# Altium project PFC_Project.PrjPcb
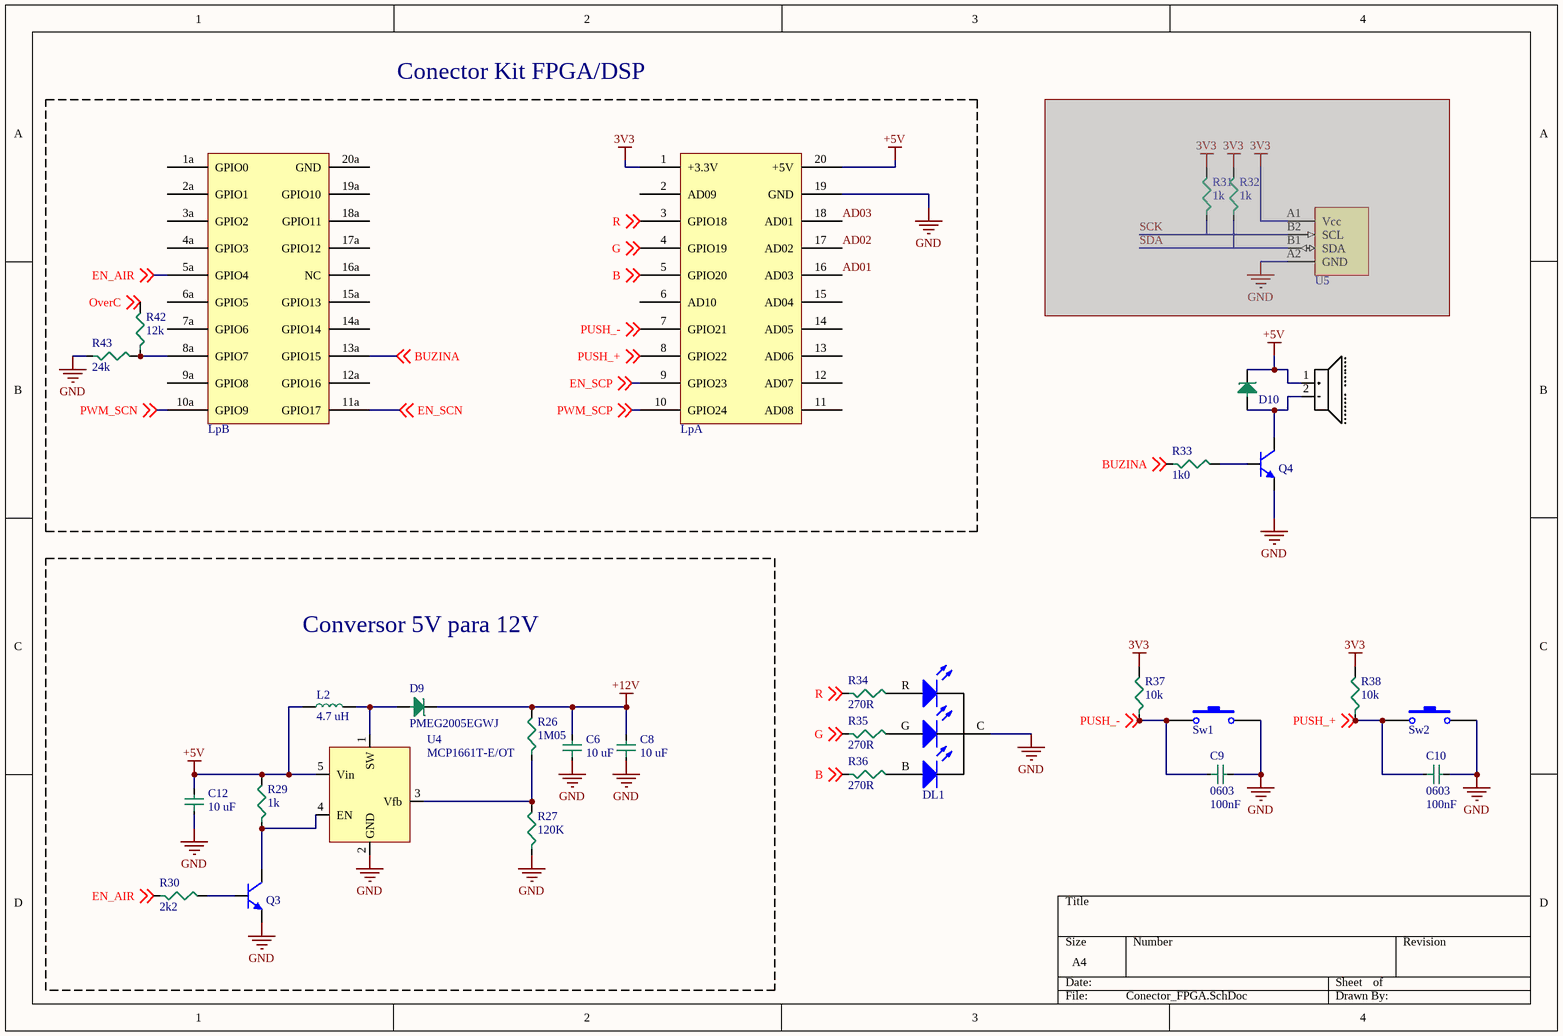
[diagram p0: Conector_FPGA.SchDoc]
1 sheet, 31 parts. Net scope: global (net labels, ports and power ports of the same name join across sheets).
Board file: PCBv2.PcbDoc

## Sheet Conector_FPGA.SchDoc
size A4

### Parts
Bz1  CMT-0502-75-SMT-TR  [BUZZER_SMD CMT-0502]  (value not drawn)
C6  value 10 uF  [0603C]  (hidden comment: 0603)
C8  value 10 uF  [0603C]  (hidden comment: 0603)
C9  0603  value 100nF  [0603C]
C10  0603  value 100nF  [0603C]
C12  value 10 uF  [0603C]  (hidden comment: 0603)
D9  PMEG2005EGWJ  [SOD-123-2]
D10  PMEG2005EGWJ  [SOD-123-2]  (value not drawn)
DL1  LED 0603  [LED SMD 0606]  (value not drawn)
L2  value 4.7 uH  [LPS5030]  (hidden comment: LPS5030-472MRB)
Lp  FPGAStartKit  [FPGA_BRUXILIS_SMD]  (value not drawn)  (parts A,B of 2)
Q3  BC-817-40  [SOT23-3N]  (value not drawn)
Q4  BC-817-40  [SOT23-3N]  (value not drawn)
R26  value 1M05  [0603]  (hidden comment: 0603)
R27  value 120K  [0603]  (hidden comment: 0603)
R29  value 1k  [0603]  (hidden comment: 0603)
R30  value 2k2  [0603]  (hidden comment: 0603)
R31  value 1k  [0603]  (hidden comment: 0603)  (masked out: inside a compile mask, not in the netlist)
R32  value 1k  [0603]  (hidden comment: 0603)  (masked out: inside a compile mask, not in the netlist)
R33  value 1k0  [0603]  (hidden comment: 0603)
R34  value 270R  [0603]  (hidden comment: 0603)
R35  value 270R  [0603]  (hidden comment: 0603)
R36  value 270R  [0603]  (hidden comment: 0603)
R37  value 10k  [0603]  (hidden comment: 0603)
R38  value 10k  [0603]  (hidden comment: 0603)
R42  value 12k  [0603]  (hidden comment: 0603)
R43  value 24k  [0603]  (hidden comment: 0603)
Sw1  SW_PUSH_BUTTON  [PUSH_BUTTON SMD]  (value not drawn)
Sw2  SW_PUSH_BUTTON  [PUSH_BUTTON SMD]  (value not drawn)
U4  MCP1661T-E/OT  [SOT-23-5]
U5  AT30TS74-UFM14-T-072  [WLCSP-4]  (value not drawn)  (masked out: inside a compile mask, not in the netlist)

### Blocks framed on the sheet
Conector Kit FPGA/DSP: Lp R42 R43
Conversor 5V para 12V: C6 C8 C12 D9 L2 Q3 R26 R27 R29 R30 U4

### Nets
3V3: Lp.1(+3.3V) R37.2 R38.2
+5V: Bz1.1 C12.2 D10.K L2.1 Lp.20(+5V) R29.2 U4.5(Vin)
+12V: C6.2 C8.2 D9.K R26.2
GND: C6.1 C8.1 C9.2 C10.2 C12.1 DL1.C(K) Lp.19(GND) Q3.2(E) Q4.2(E) R27.1 R43.1 Sw1.2 Sw2.2 U4.2(GND)
AD01: Lp.16(AD03)
AD02: Lp.17(AD02)
AD03: Lp.18(AD01)
B: Lp.5(GPIO20) R36.1 ; off-sheet B
BUZINA: Lp.13a(GPIO15) R33.1 ; off-sheet BUZINA
EN_AIR: Lp.5a(GPIO4) R30.1 ; off-sheet EN_AIR
EN_SCN: Lp.11a(GPIO17) ; off-sheet EN_SCN
EN_SCP: Lp.9(GPIO23) ; off-sheet EN_SCP
G: Lp.4(GPIO19) R35.1 ; off-sheet G
OverC: R42.2 ; off-sheet OverC
PUSH_+: C10.1 Lp.8(GPIO22) R38.1 Sw2.1 ; off-sheet PUSH_+
PUSH_-: C9.1 Lp.7(GPIO21) R37.1 Sw1.1 ; off-sheet PUSH_-
PWM_SCN: Lp.10a(GPIO9) ; off-sheet PWM_SCN
PWM_SCP: Lp.10(GPIO24) ; off-sheet PWM_SCP
R: Lp.3(GPIO18) R34.1 ; off-sheet R
NetBz1_2: Bz1.2 D10.A Q4.3(C)
NetD9_A: D9.A L2.2 U4.1(SW)
NetDL1_B: DL1.B(A) R36.2
NetDL1_G: DL1.G(A) R35.2
NetDL1_R: DL1.R(A) R34.2
NetLp_8a: Lp.8a(GPIO7) R42.1 R43.2
NetQ3_1: Q3.1(B) R30.2
NetQ3_3: Q3.3(C) R29.1 U4.4(EN)
NetQ4_1: Q4.1(B) R33.2
NetR26_1: R26.1 R27.2 U4.3(Vfb)

Not connected (* = marked no-connect by the designer): Lp 1a(GPIO0) 2(AD09) 2a(GPIO1) 3a(GPIO2) 4a(GPIO3) 6(AD10) 6a(GPIO5) 7a(GPIO6) 9a(GPIO8) 11(AD08) 12(AD07) 12a(GPIO16) 13(AD06) 14(AD05) 14a(GPIO14) 15(AD04) 15a(GPIO13) 16a(NC) 17a(GPIO12) 18a(GPIO11) 19a(GPIO10) 20a(GND)

### Library data of the parts
Bz1 = Buzzer SMD 5x2 mm: Speakers & Transducers buzzer, 5 mm, 2 mm deep, M, 3 V, 75 dB, Surface Mount (SMT), Audio Transducer; ComponentLink1Description: MOUSER; ComponentLink1URL: https://br.mouser.com/ProductDetail/490-CMT-0502-75SMTTR; ComponentLink2Description: DATASHEET; ComponentLink2URL: https://br.mouser.com/datasheet/2/670/cmt-0502-75-smt-tr-1777157.pdf
C6 C8-C10 C12 = Capacitor SMD 0603
D9 D10 = Diodo Schottky PMEG2005: Schottky Diodes & Rectifiers SCHOTTKY DIODES; ComponentLink1Description: MOUSER; ComponentLink1URL: https://br.mouser.com/ProductDetail/841-PMEG2005EGWJ; ComponentLink2Description: DATASHEET; ComponentLink2URL: https://br.mouser.com/datasheet/2/916/PMEG6010CEGW-1599909.pdf
DL1 = LED RGB 0606 SMD: Standard LEDs - SMD 1.6X1.6MM RGB SMD LED; Published: 8-Jun-2000; LatestRevisionDate: 08-Jul-2005; LatestRevisionNote: Mech Layer 1 removed.; PackageReference: LED-0; Publisher: Altium Limited; ComponentLink1Description: Mouser; ComponentLink1URL: https://br.mouser.com/ProductDetail/604-APTF1616SEJ3ZGGV
L2 = Indutor LPS5030-472MRB SMD: Fixed Inductors 4.7uH Shld 20% 2A 83mOhms; ComponentLink1Description: MOUSER; ComponentLink1URL: https://br.mouser.com/ProductDetail/994-LPS5030-472MRB; ComponentLink2Description: DATASHEET; ComponentLink2URL: https://br.mouser.com/datasheet/2/597/lps5030-270738.pdf
Lp = FPGAStart
Q3 Q4 = BC-817-40: NPN General Purpose Amplifier; Published: 8-Jun-2000; LatestRevisionDate: 15-Jan-2003; LatestRevisionNote: PCB Footprint 'BCY-W3/D4.7' replaced; DatasheetVersion: 1997; PackageVersion: Sep-1998; PackageReference: TO-92A; Publisher: Altium Limited; Code_JEDEC: TO-92A; ComponentLink1Description: Manufacturer Link; ComponentLink1URL: http://www.fairchildsemi.com/; ComponentLink2Description: Datasheet; ComponentLink2URL: http://www.fairchildsemi.com/ds/2N%2F2N3904.pdf
R26 R27 R29-R38 R42 R43 = Resistor SMD 0603 1/10 W: %: ±1%; P: 1/8W
Sw1 Sw2 = SW-PB SMD: Switch Push Button SMD; Published: 24-Mar-1999; LatestRevisionDate: 17-Jul-2002; LatestRevisionNote: Re-released for DXP Platform.; PackageReference: SPST-2; Publisher: Altium Limited
U4 = MCP1661: Switching Voltage Regulators 32V Output Non-synch Boost Regulator; ComponentLink1Description: datasheet; ComponentLink1URL: https://br.mouser.com/datasheet/2/268/20005315A-357524.pdf; ComponentLink2Description: mouser; ComponentLink2URL: https://br.mouser.com/ProductDetail/579-MCP1661T-E-OT
U5 = Sensor Temperatura AT30TS74: Board Mount Temperature Sensors 4Ch, 1.7-5.5V, 3.4MHz, H-Tmp, 4-WLCSP; ComponentLink1Description: MOUSER; ComponentLink1URL: https://br.mouser.com/ProductDetail/556-T30TS74UFM14T072; ComponentLink2Description: DATASHEET; ComponentLink2URL: https://br.mouser.com/datasheet/2/268/Web_AT30TS74_0217-1509249.pdf